# EAGLE design 314_ble_nrf52 (EAGLE 9.6.2)
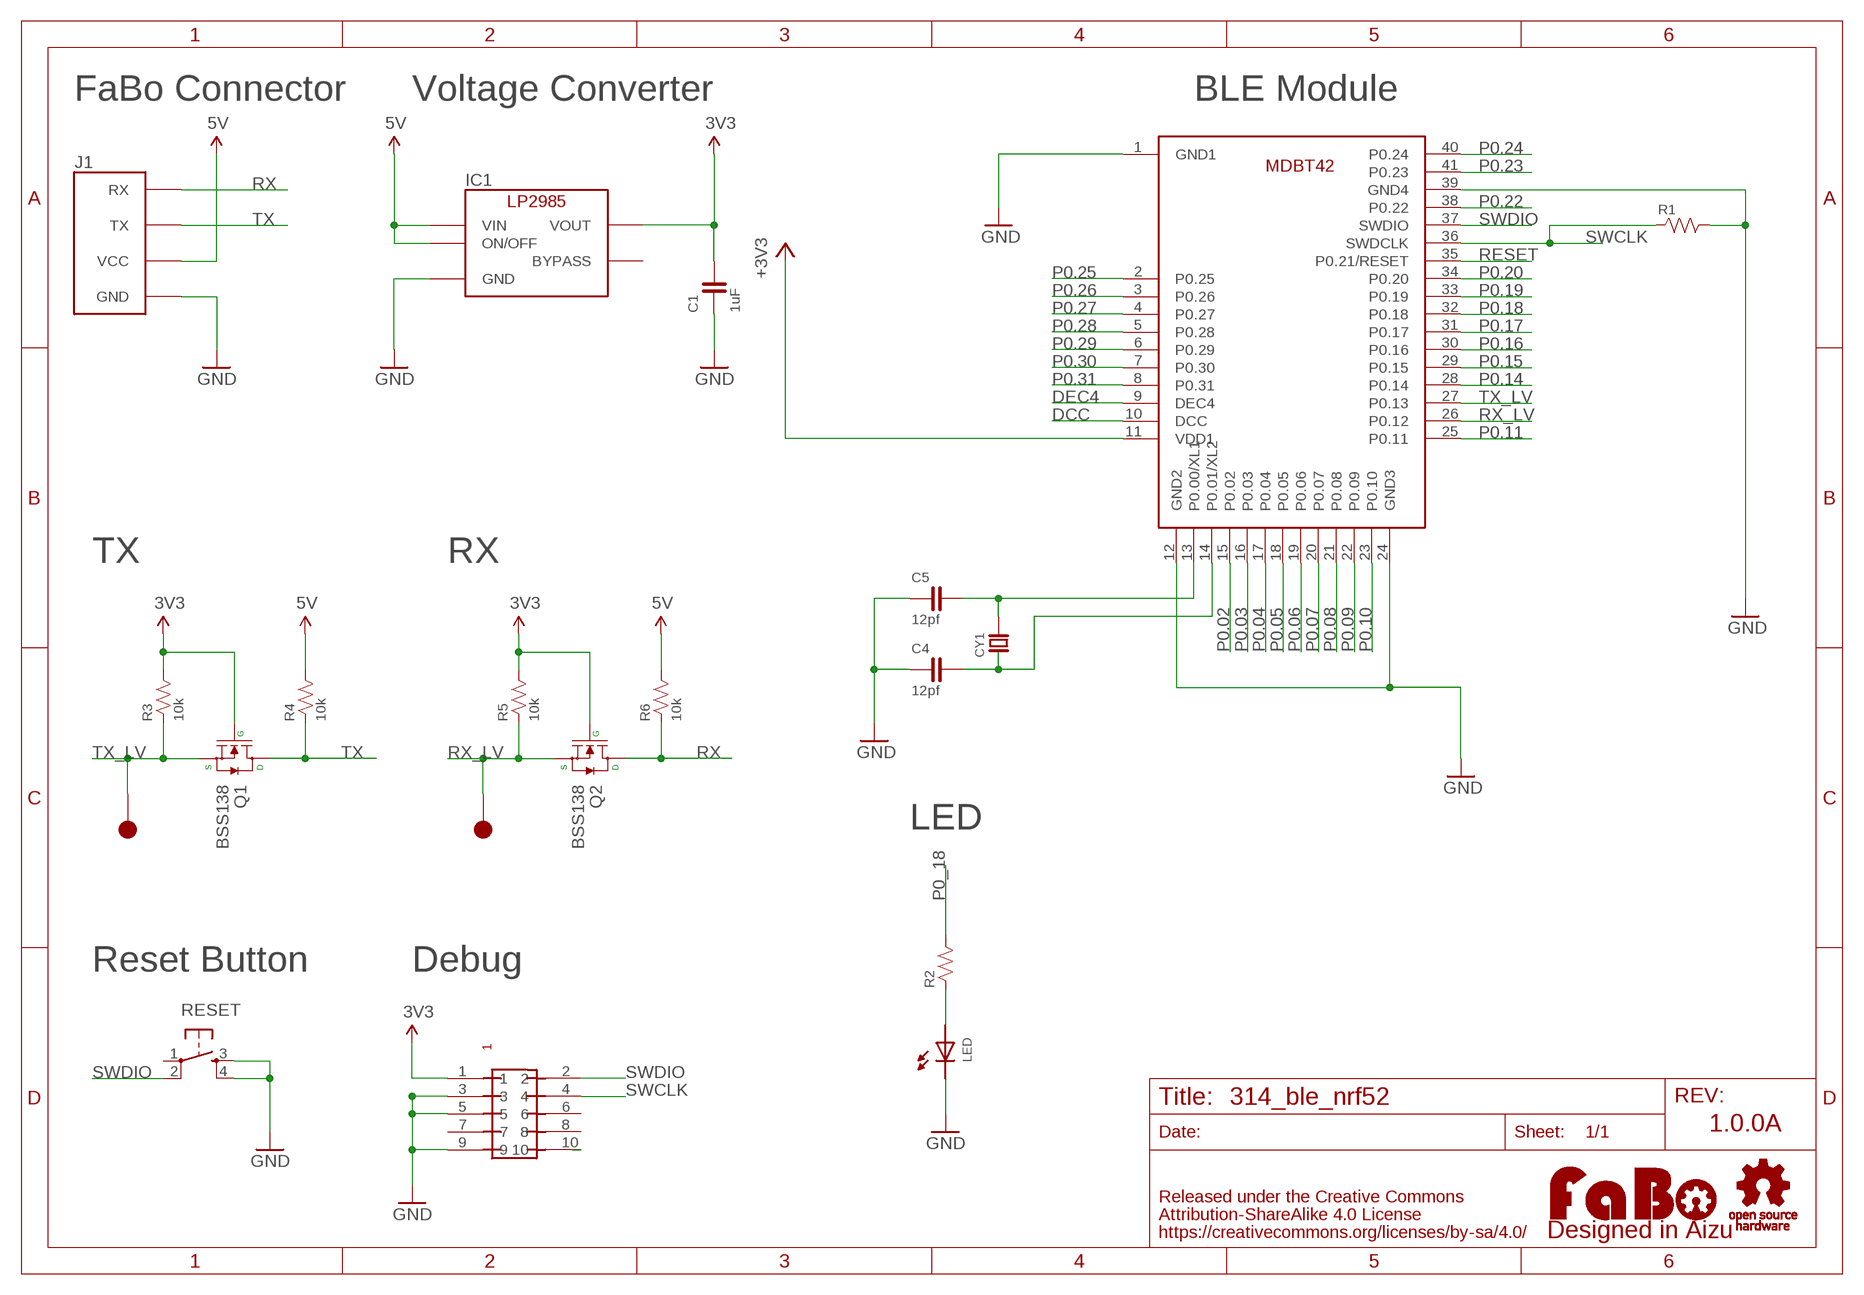
[diagram p0: schematic, sheet 1]

## Parts
C1  1uF  CAPACITOR-0603_NARROW  [0603-NARROW]
C4  12pf  CAPACITOR-0603  [0603]
C5  12pf  CAPACITOR-0603  [0603]
CY1  CRYSTAL-ABS07  [ABRACON-ABS07-32.768KHZ]
IC1  LP2985-33DBV  [SOT-23-5]
J1  FABO_BRICK_SERIAL  [FABO_BRICK_SERIAL]
LED  LED-0603  [0603]
LOGO1  LOGO_FABO-M_BOTTOM  [LOGO_FABO_M_BOTTOM]
Q1  BSS138  MOSFET-N-BSS138  [SOT23-3]
Q2  BSS138  MOSFET-N-BSS138  [SOT23-3]
R1  RESISTOR-0603  [0603]
R2  RESISTOR-0603-NARROW  [0603-NARROW]
R3  10k  RESISTOR-0603-NARROW  [0603-NARROW]
R4  10k  RESISTOR-0603-NARROW  [0603-NARROW]
R5  10k  RESISTOR-0603-NARROW  [0603-NARROW]
R6  10k  RESISTOR-0603-NARROW  [0603-NARROW]
RESET  TACT-SWITCH-SMD_KMR2  [KMR2]
TP10  TP-15  [TP-15]
TP11  TP-15  [TP-15]
U$2  LOGO_OSHW-M_BOTTOM  [LOGO_OSHW_M_BOTTOM]
U$4  RAYTAC-MDBT42  [RAYTAC-MDBT42]
U$8  PIN-HEADER-SMT(1.27MM)2X5  [PIN-HEADER-SMT(1.27MM)2X5]

## Nets
3V3: C1.2 IC1.5(VOUT) Q1.1(G) Q2.1(G) R3.2 R5.2 U$8.1
5V: IC1.1(VIN) IC1.3(ON/OFF) J1.VCC R4.2 R6.2
+3V3: U$4.11(VDD1)
DCC: U$4.10(DCC)
DEC4: U$4.9(DEC4)
GND: C1.1 C4.1 C5.1 IC1.2(GND) J1.GND LED.CATHODE R1.2 RESET.3 RESET.4 U$4.1(GND1) U$4.12(GND2) U$4.24(GND3) U$4.39(GND4) U$8.3 U$8.5 U$8.9
N$3: LED.ANODE R2.1
N$7: C5.2 CY1.P$2 U$4.13(P0.00/XL1)
N$8: C4.2 CY1.P$1 U$4.14(P0.01/XL2)
P0.02: U$4.15(P0.02)
P0.03: U$4.16(P0.03)
P0.04: U$4.17(P0.04)
P0.05: U$4.18(P0.05)
P0.06: U$4.19(P0.06)
P0.07: U$4.20(P0.07)
P0.08: U$4.21(P0.08)
P0.09: U$4.22(P0.09)
P0.10: U$4.23(P0.10)
P0.11: U$4.25(P0.11)
P0.14: U$4.28(P0.14)
P0.15: U$4.29(P0.15)
P0.16: U$4.30(P0.16)
P0.17: U$4.31(P0.17)
P0.18: U$4.32(P0.18)
P0.19: U$4.33(P0.19)
P0.20: U$4.34(P0.20)
P0.22: U$4.38(P0.22)
P0.23: U$4.41(P0.23)
P0.24: U$4.40(P0.24)
P0.25: U$4.2(P0.25)
P0.26: U$4.3(P0.26)
P0.27: U$4.4(P0.27)
P0.28: U$4.5(P0.28)
P0.29: U$4.6(P0.29)
P0.30: U$4.7(P0.30)
P0.31: U$4.8(P0.31)
P0_18: R2.2
RESET: U$4.35(P0.21/RESET) U$8.10
RX: J1.RX Q2.3(D) R6.1
RX_LV: Q2.2(S) R5.1 TP10.1 U$4.26(P0.12)
SWCLK: R1.1 U$4.36(SWDCLK) U$8.4
SWDIO: RESET.2 U$4.37(SWDIO) U$8.2
TX: J1.TX Q1.3(D) R4.1
TX_LV: Q1.2(S) R3.1 TP11.1 U$4.27(P0.13)
Unconnected: IC1.4(BYPASS) RESET.1 U$8.6 U$8.7 U$8.8

## Notes on the sheet
- FaBo Connector | Voltage Converter | BLE Module
- TX | RX
- LED
- Reset Button | Debug
- 1.0.0A

## Library data of the parts
C1 C4 C5 = FaBo-Capacitor:CAPACITOR: CAPACITOR
CY1 = FaBo-Crystal:CRYSTAL
IC1 = FaBo-Supply:LP2985: LP2985
J1 = FaBo-Template:FABO_BRICK_SERIAL: FaBo Brick Serial
LED = FaBo-LED:LED
LOGO1 = component:LOGO_FABO
Q1 Q2 = FaBo-etc:MOSFET-N
R1-R6 = FaBo-Resistors:RESISTOR: RESISTOR
RESET = FaBo-Switch:TACT-SWITCH
TP10 TP11 = FaBo-Supply:TP
U$2 = FaBo-etc:LOGO_OSHW
U$4 = FaBo-BT:RAYTAC-MDBT42
U$8 = GClue:PIN-HEADER-SMT(1.27MM)2X5: PIN-HEADER-SMT (1.27MM) 2x5

## Board
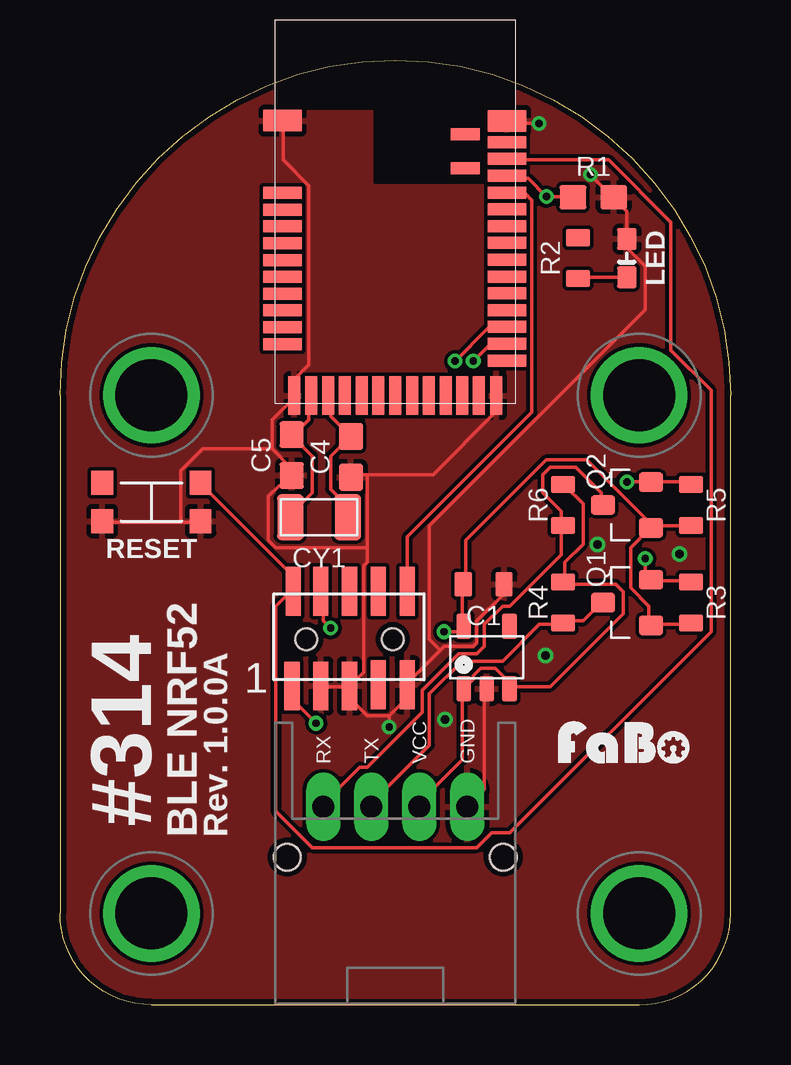
[diagram p1: board, top side]
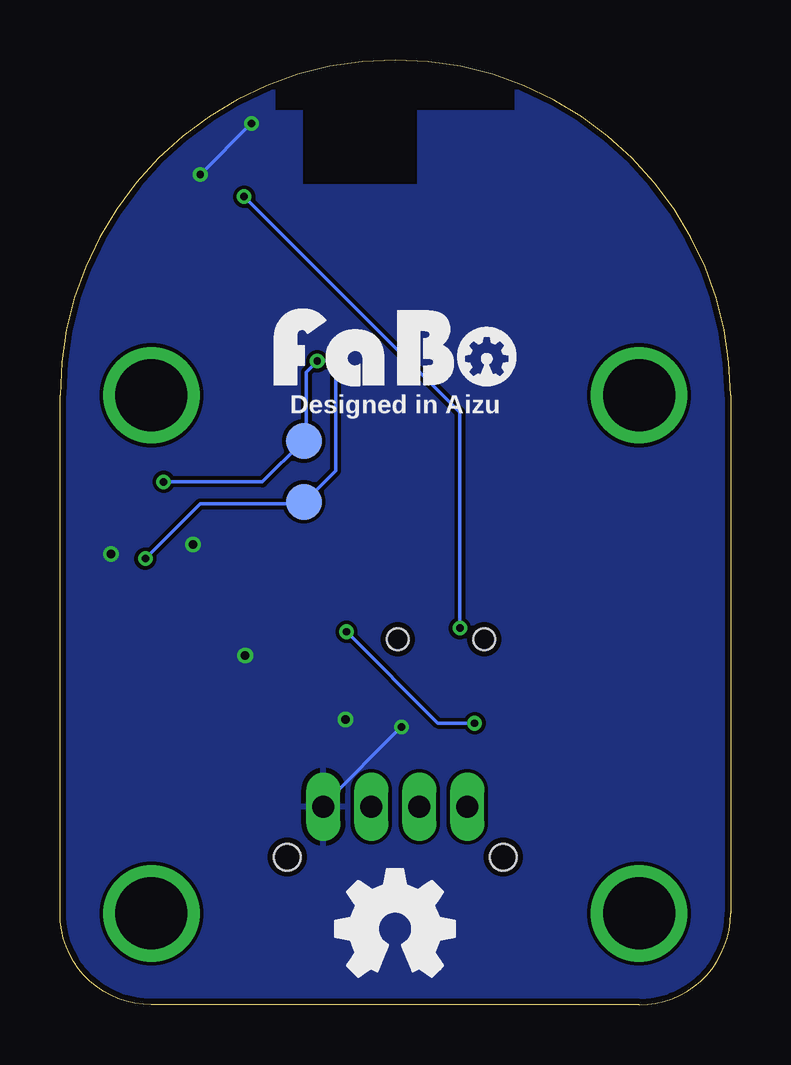
[diagram p2: board, bottom side, seen from below]

Size 27.94 x 39.37 mm. Coordinates in mm from the lower left corner, seen from the top.
Copper layers (1*16): Top 0.035mm / dielectric 1.6mm / Bottom 0.035mm
Design rules "PCBway": minimum track width 6mil, minimum drill 12mil, track to track 6mil, track to pad 6mil, pad to pad 6mil, via to via 6mil, smd to smd 6mil, copper to edge 10mil, drill to drill 10mil, minimum pad ring 10mil, minimum via ring 6mil, stop-mask expansion 2mil, vias tented up to drill 100mil, thermal gap 8mil

### Footprints (pad centres in the part's own frame; a part is rotated, then mirrored left to right if it is on the bottom)
0603-NARROW = smd 0.71 x 1: 1 -0.85,0; 2 0.85,0
0603 = smd 1.1 x 1: 1 -0.85,0; 2 0.85,0
ABRACON-ABS07-32.768KHZ = smd 1.1 x 1.9: P$1 -1.2,0; P$2 1.2,0
SOT-23-5 = smd 0.6 x 1.05: 1 -0.95,-1.3; 2 0,-1.3; 3 0.95,-1.3; 4 0.95,1.3; 5 -0.95,1.3
FABO_BRICK_SERIAL = drill 0.9 pad 1.422 long: GND 3,-10.795; RX -3,-10.795; TX -1,-10.795; VCC 1,-10.795 | drill 3 pad 3.81: P$1 -10.16,6.35; P$2 10.16,6.35; P$3 -10.16,-15.24; P$4 10.16,-15.24 | hole 1.1: -4.5,-12.895; 4.5,-12.895
0603' = smd 0.9 x 0.8: ANODE -0.8,0; CATHODE 0.8,0
SOT23-3 = smd 0.8 x 1: 1 -0.95,-1; 2 0.95,-1; 3 0,1
KMR2 = smd 0.9 x 1: 1 -2.05,0.8; 2 2.05,0.8; 3 2.05,-0.8; 4 -2.05,-0.8
TP-15 = smd 1.5 x 1.5: 1 0,0
RAYTAC-MDBT42 = smd 1.6 x 0.9: 1 -4.7,3.8; 39 4.65,3.79 | smd 1.6 x 0.5: 2 -4.7,0.79; 3 -4.7,0.09; 4 -4.7,-0.61; 5 -4.7,-1.31; 6 -4.7,-2.01; 7 -4.7,-2.71; 8 -4.7,-3.41; 9 -4.7,-4.11; 10 -4.7,-4.81; 11 -4.7,-5.51; 25 4.65,-6.2; 26 4.65,-5.5; 27 4.65,-4.8; 28 4.65,-4.1; 29 4.65,-3.4; 30 4.65,-2.7; 31 4.65,-2; 32 4.65,-1.3; 33 4.65,-0.6; 34 4.65,0.1; 35 4.65,0.8; 36 4.65,1.5; 37 4.65,2.2; 38 4.65,2.9 | smd 0.5 x 1.6: 12 -4.2,-7.66; 13 -3.5,-7.66; 14 -2.8,-7.66; 15 -2.1,-7.66; 16 -1.4,-7.66; 17 -0.7,-7.66; 18 0,-7.66; 19 0.7,-7.66; 20 1.4,-7.66; 21 2.1,-7.66; 22 2.8,-7.66; 23 3.48,-7.66; 24 4.2,-7.66 | smd 1.2 x 0.5: 40 2.91,3.23; 41 2.92,1.81
PIN-HEADER-SMT(1.27MM)2X5 = smd 0.635 x 2.032: 1 -2.4,-1.95; 2 -2.35,2; 3 -1.2,-1.95; 4 -1.2,2; 5 0,-1.95; 6 0,2; 7 1.2,-1.9; 8 1.2,2; 9 2.4,-1.9; 10 2.4,2 | hole 0.9: 1.8,0; -1.8,0

### Placement (x,y rotation side)
C1  17.65,17.53 180 top
C4  12.12,22.83 90 top
C5  9.66,22.91 90 top
CY1  10.79,20.32 180 top
IC1  17.78,14.48 0 top
J1  13.97,19.05 0 top
LED  [0603']  23.62,31.11 90 top
LOGO1  13.97,25.4 0 top
Q1  23.62,16.76 90 top
Q2  23.62,20.83 90 top
R1  22.23,33.66 0 top
R2  21.59,31.11 90 top
R3  26.29,16.76 270 top
R4  20.95,16.76 90 top
R5  26.29,20.83 270 top
R6  20.95,20.83 90 top
RESET  3.81,20.95 0 top
TP10  17.78,23.5 0 bottom
TP11  17.78,20.95 0 bottom
U$2  13.97,3.17 0 top
U$4  13.97,33.05 0 top
U$5  [LOGO_FABO_S]  23.55,9.91 0 top
U$8  12.06,15.24 0 top

### Tracks (layer width: path | path; a pad name or v marks a point on that pad's centre or on a via)
3V3  (via drill 0.3)
  Top 0.152: R3.2 26.21,15.85 24.69,15.85 Q1.1 24.54,15.85 24.54,16.61 23.77,17.37 23.77,19.05 24.54,19.81 Q2.1 24.69,19.96 | 24.69,19.96 26.21,19.96 R5.2 | 24.69,19.96 21.95,22.71 20.27,22.71 16.92,19.36 16.92,17.53 C1.2 16.76,17.53 16.76,15.85 IC1.5 16.76,15.7 16.61,15.54 v16,15.54 | v10.67,11.73 9.75,12.65 9.75,13.26 U$8.1
  Bottom 0.152: v10.67,11.73 12.19,11.73 v16,15.54
5V
  Top 0.152: R6.2 21.03,21.64 21.79,20.88 21.79,19.2 21.03,18.44 21.03,17.68 R4.2 21.03,17.53 23.16,17.53 23.47,17.22 23.47,16.31 20.42,13.26 18.75,13.26 IC1.3 18.59,13.26 18.59,13.56 18.14,14.02 17.53,14.02 17.22,13.72 17.22,13.56 16.92,13.26 IC1.1 16.76,13.11 16.76,10.21 14.94,8.38 J1.VCC
GND  (via drill 0.3, 0.35)
  Top 0.152: 5.03,20.12 5.79,20.12 RESET.3 | 5.03,20.12 1.83,20.12 RESET.4 | 8.84,23.16 9.6,22.4 9.6,22.1 C5.1 9.6,21.95 9.3,21.64 9.14,21.64 8.69,21.18 8.69,19.36 8.99,19.05 12.8,19.05 | 8.84,23.16 8.84,24.38 9.75,25.3 U$4.12 9.91,25.45 9.91,26.21 10.36,26.67 10.36,34.14 9.3,35.2 9.3,36.73 U$4.1 | 5.03,20.12 5.03,22.25 5.94,23.16 8.84,23.16 | v19.96,36.73 18.75,36.73 U$4.39 | v22.1,34.59 23.01,33.68 R1.2 23.16,33.53 23.62,33.07 LED.CATHODE 23.62,31.55 24.38,30.79 24.38,28.96 15.39,19.96 15.39,15.24 15.85,14.78 | 12.8,22.1 15.54,22.1 18.14,24.69 18.14,25.3 U$4.24 | 12.8,22.1 12.19,22.1 C4.1 | IC1.2 17.68,13.11 17.68,8.99 17.07,8.38 J1.GND | U$8.3 10.97,13.26 12.04,13.26 U$8.5 | 15.85,14.78 14.48,13.41 U$8.9 14.33,13.26 14.33,12.65 13.72,12.04 | 15.85,14.78 16,14.94 17.22,14.94 17.37,15.09 17.37,16 18.44,17.07 18.44,17.53 C1.1 | 13.72,12.04 12.8,12.04 12.19,12.65 12.19,13.26 U$8.5 | 13.72,12.04 v13.72,11.58 | 12.8,19.05 12.8,18.44 12.65,18.29 12.65,13.87 12.19,13.41 U$8.5 | 12.8,19.05 12.8,22.1
  Bottom 0.152: v22.1,34.59 v19.96,36.73 | v13.72,11.58 16.92,8.38 J1.GND
  other vias: 16.05,11.89 20.22,14.56 22.4,19.18 25.81,18.79
  pour Bottom: 0,0 27.94,0 27.94,39.37 0,39.37
  pour Top: 0,0 27.94,0 27.94,39.37 0,39.37
N$3
  Top 0.152: LED.ANODE 23.62,30.33 21.64,30.33 R2.1
N$7
  Top 0.152: U$4.13 10.36,25.3 10.36,24.38 9.75,23.77 C5.2 9.75,23.62 10.52,22.86 10.52,21.34 9.6,20.42 CY1.P$2
N$8
  Top 0.152: U$4.14 11.28,25.3 11.28,24.54 12.04,23.77 C4.2 12.04,23.62 11.28,22.86 11.28,21.49 11.89,20.88 11.89,20.42 CY1.P$1
RESET
  Top 0.152: U$4.35 18.75,33.83 19.36,33.83 19.66,33.53 19.66,24.69 14.48,19.51 14.48,17.37 U$8.10
RX
  Top 0.152: Q2.3 22.55,20.88 22.55,21.34 21.49,22.4 20.42,22.4 20.12,22.1 20.12,21.34 20.88,20.57 20.88,20.12 R6.1 20.88,19.96 20.88,18.75 18.75,16.61 18.44,16.61 17.68,15.85 17.68,14.94 17.37,14.63 16.61,14.63 15.09,13.11 15.09,12.19 12.8,9.91 12.5,9.91 10.97,8.38 J1.RX
RX_LV  (via drill 0.3)
  Top 0.152: R5.1 26.21,21.79 24.69,21.79 Q2.2 24.54,21.79 v23.62,21.79 | v17.22,26.82 17.83,27.43 18.59,27.43 U$4.26
  Bottom 0.152: v17.22,26.82 17.68,26.36 17.68,23.62 TP10.1 17.83,23.47 19.51,21.79 v23.62,21.79
SWCLK  (via drill 0.3)
  Top 0.152: R1.1 21.34,33.68 v20.27,33.68 19.51,34.44 18.75,34.44 U$4.36 | v11.28,15.7 10.97,16 10.97,17.22 U$8.4
  Bottom 0.152: v11.28,15.7 11.28,24.69 v20.27,33.68
SWDIO
  Top 0.152: RESET.2 5.94,21.64 9.6,17.98 9.6,17.37 U$8.2 9.6,17.22 8.99,16.61 8.99,8.08 10.52,6.55 17.37,6.55 17.98,7.16 18.75,7.16 27.13,15.54 27.13,25.6 25.45,27.28 25.45,32.61 22.86,35.2 18.75,35.2 U$4.37
TX
  Top 0.152: Q1.3 22.55,16.76 21.79,16 21.03,16 R4.1 20.88,15.85 19.96,15.85 18.44,14.33 16.76,14.33 15.39,12.95 15.39,10.82 12.95,8.38 J1.TX
TX_LV  (via drill 0.3)
  Top 0.152: R3.1 26.21,17.68 24.69,17.68 Q1.2 24.54,17.83 24.38,17.98 v24.38,18.59 | v16.46,26.82 17.83,28.19 18.59,28.19 U$4.27
  Bottom 0.152: v24.38,18.59 22.1,20.88 17.83,20.88 TP11.1 17.68,21.03 16.46,22.25 v16.46,26.82

### Text on the board
tPlace: RESET | #314 | BLE NRF52 | Rev. 1.0.0A
bPlace: Designed in Aizu